# Altium schematic sheet MMBT3904LT1G.schdoc
size 127 x 101 mm
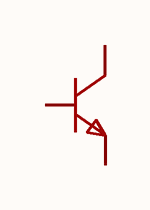
[diagram p0: MMBT3904LT1G.schdoc]

## Parts
Q?  mmbt3904lt1g  [SOT-23-3_L2.9-W1.6-P1.90-LS2.8-BR]  (value not drawn)

## Nets

Not connected (* = marked no-connect by the designer): Q? 1 2 3

## Library data of the parts
Q? = mmbt3904lt1g: 晶体管类型:NPN;集电极电流(Ic):200mA;集射极击穿电压(Vceo):40V;耗散功率(Pd):225mW;直流电流增益(hFE):40@0.1mA,1.0V;; Manufacturer: onsemi(安森美); AddInBom: yes; ModelId: 89cb27a44ab2466697082bb9fd73a7d0; ModelName: SOT-23-3L_L2.9-W1.6-H1.1-LS2.8-P0.95; ModelTransform: 114.173,110.236,0,90,0,0,0,0,0; type: NPN; Current - Collector(Ic): 200mA; Collector - Emitter Voltage VCEO: 40V; Pd - Power Dissipation: 225mW; Transition frequency(fT): 300MHz; Current - Collector Cutoff: 50nA; Vce Saturation(VCE(sat)): 200mV; Symbol: MMBT3904LT1G; LCSC Part Name: NPN 电流:200mA 电压:40V; SupplierPart: C81464; ManufacturerPart: MMBT3904LT1G; Supplier Footprint: SOT-23; JLCPCB Part Class: Extended Part; Datasheet: https://item.szlcsc.com/datasheet/MMBT3904LT1G/82615.html; Supplier: LCSC; ConvertToPcb: yes; FootprintName: SOT-23-3_L2.9-W1.6-P1.90-LS2.8-BR; DC Current Gain: 40@0.1mA,1.0V; Operating Temperature: -55℃~+150℃